# EAGLE design adcmp582-sampler-v2 (EAGLE 9.4.1)
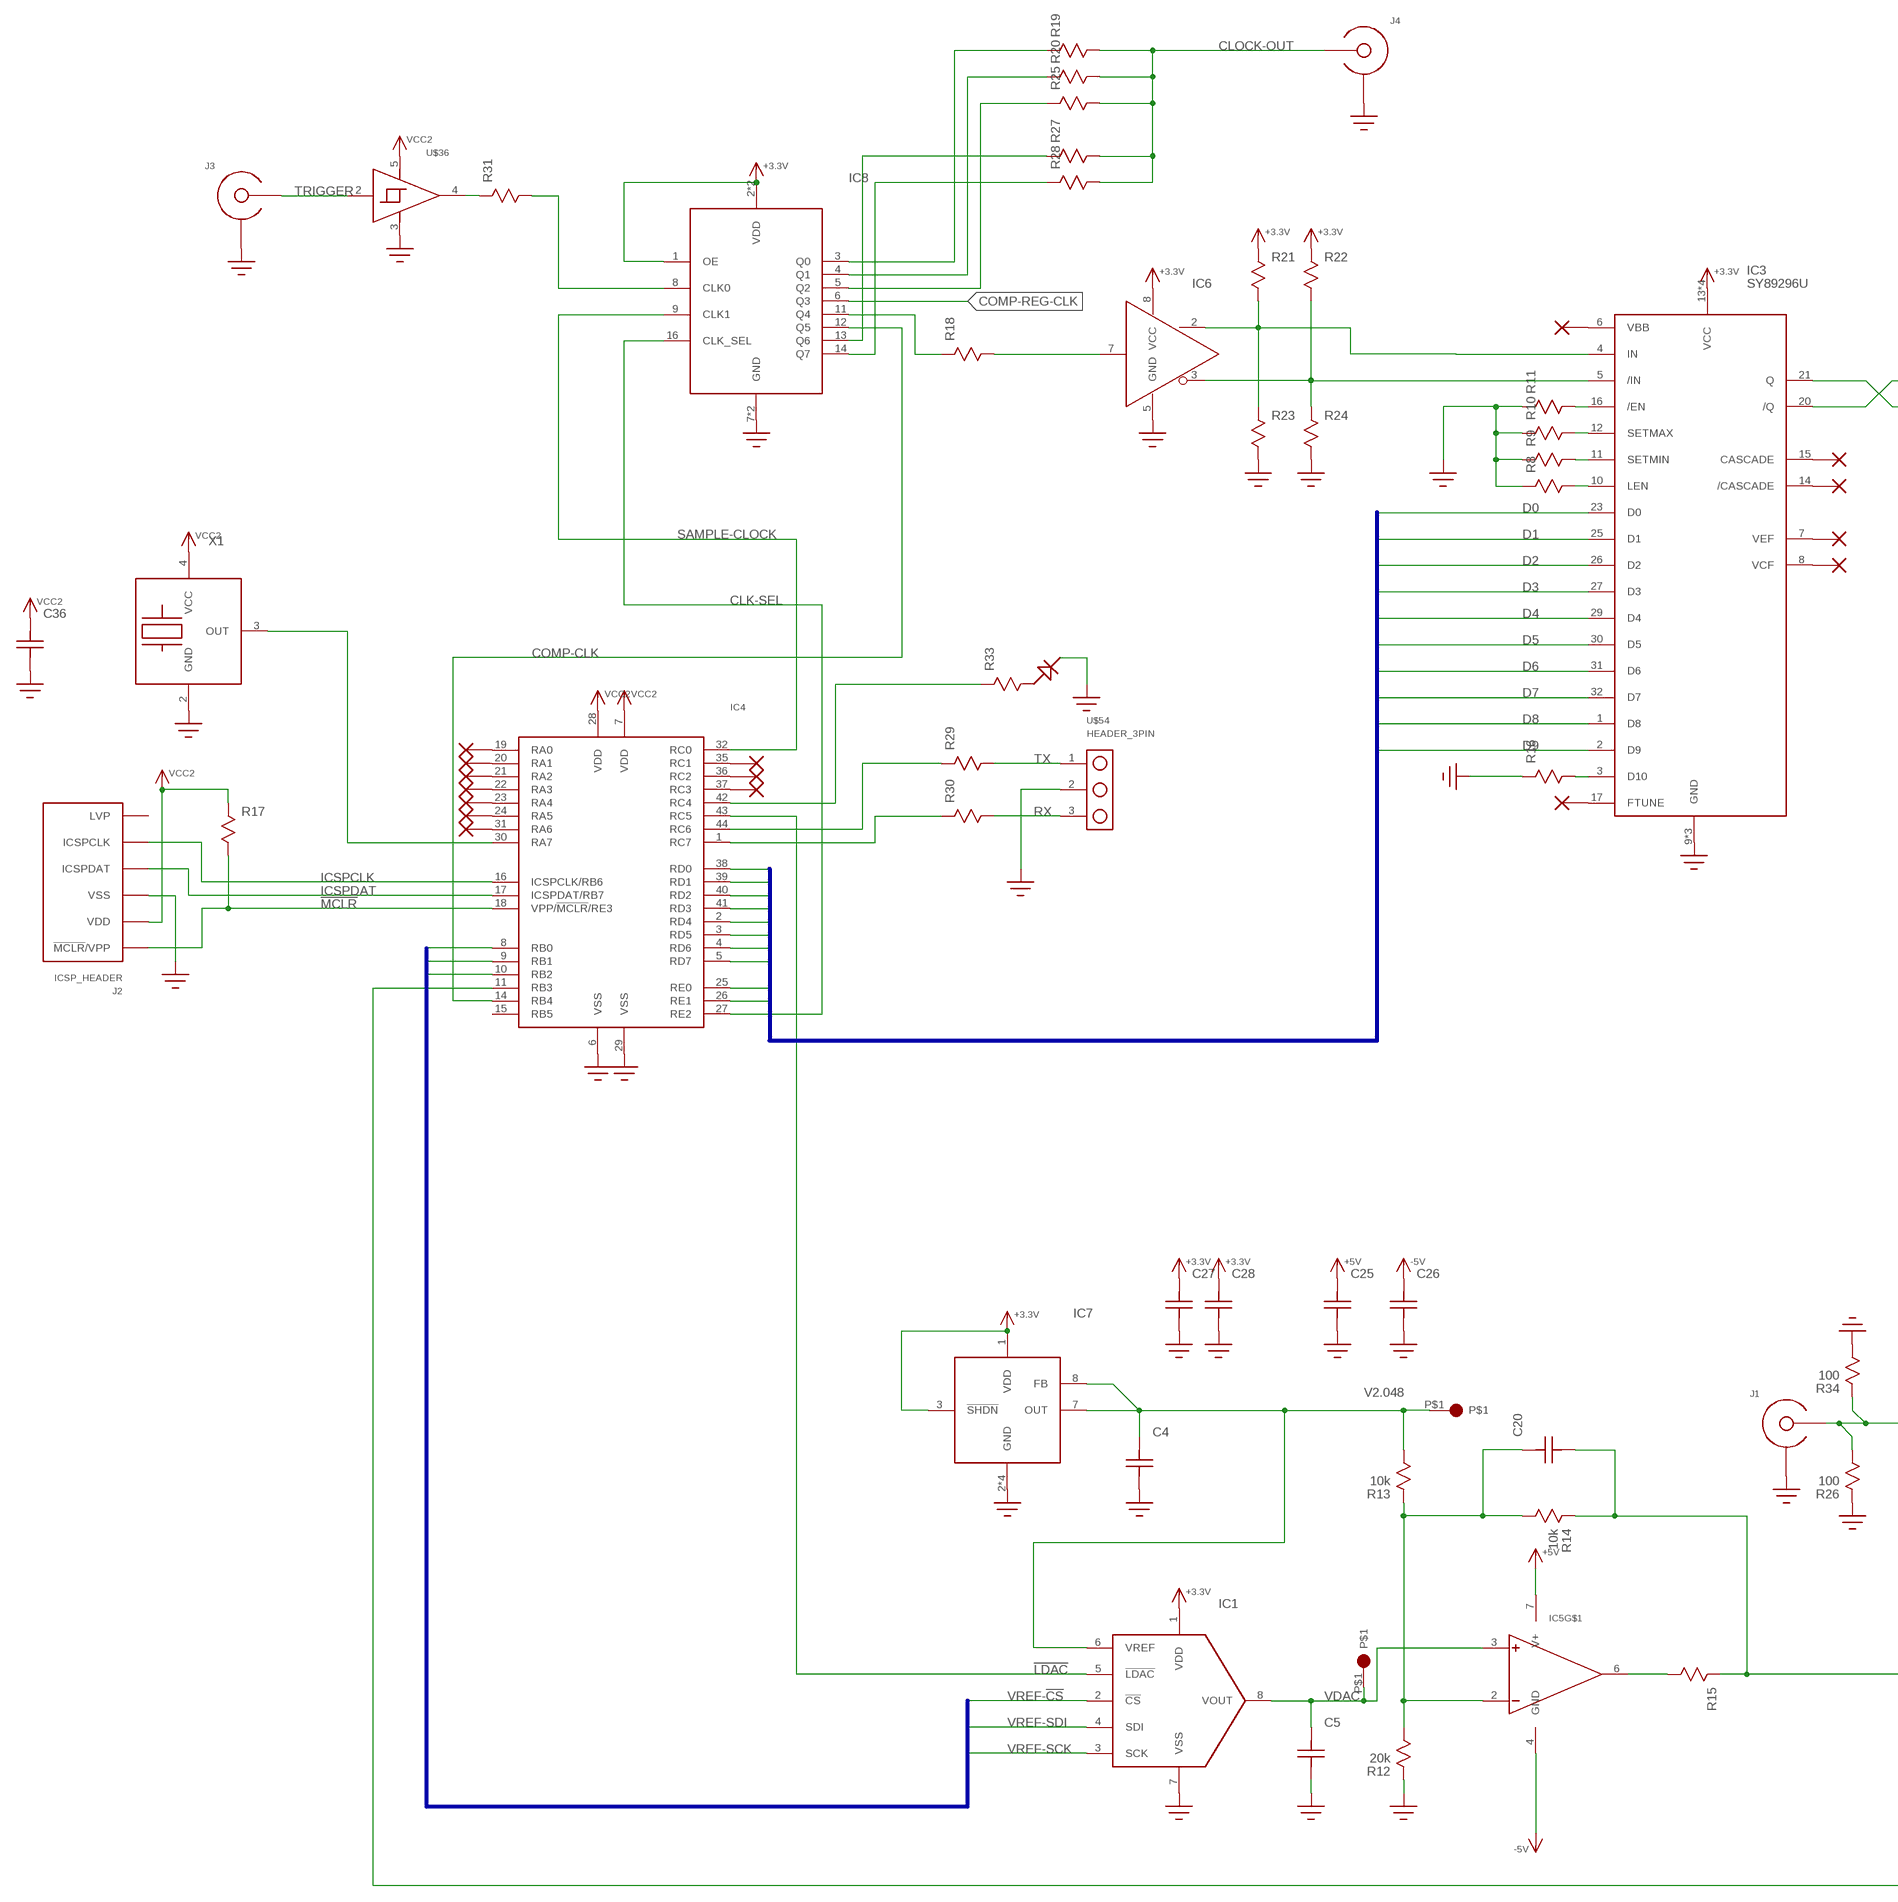
[diagram p0: schematic, sheet 1, part 1 of 2]
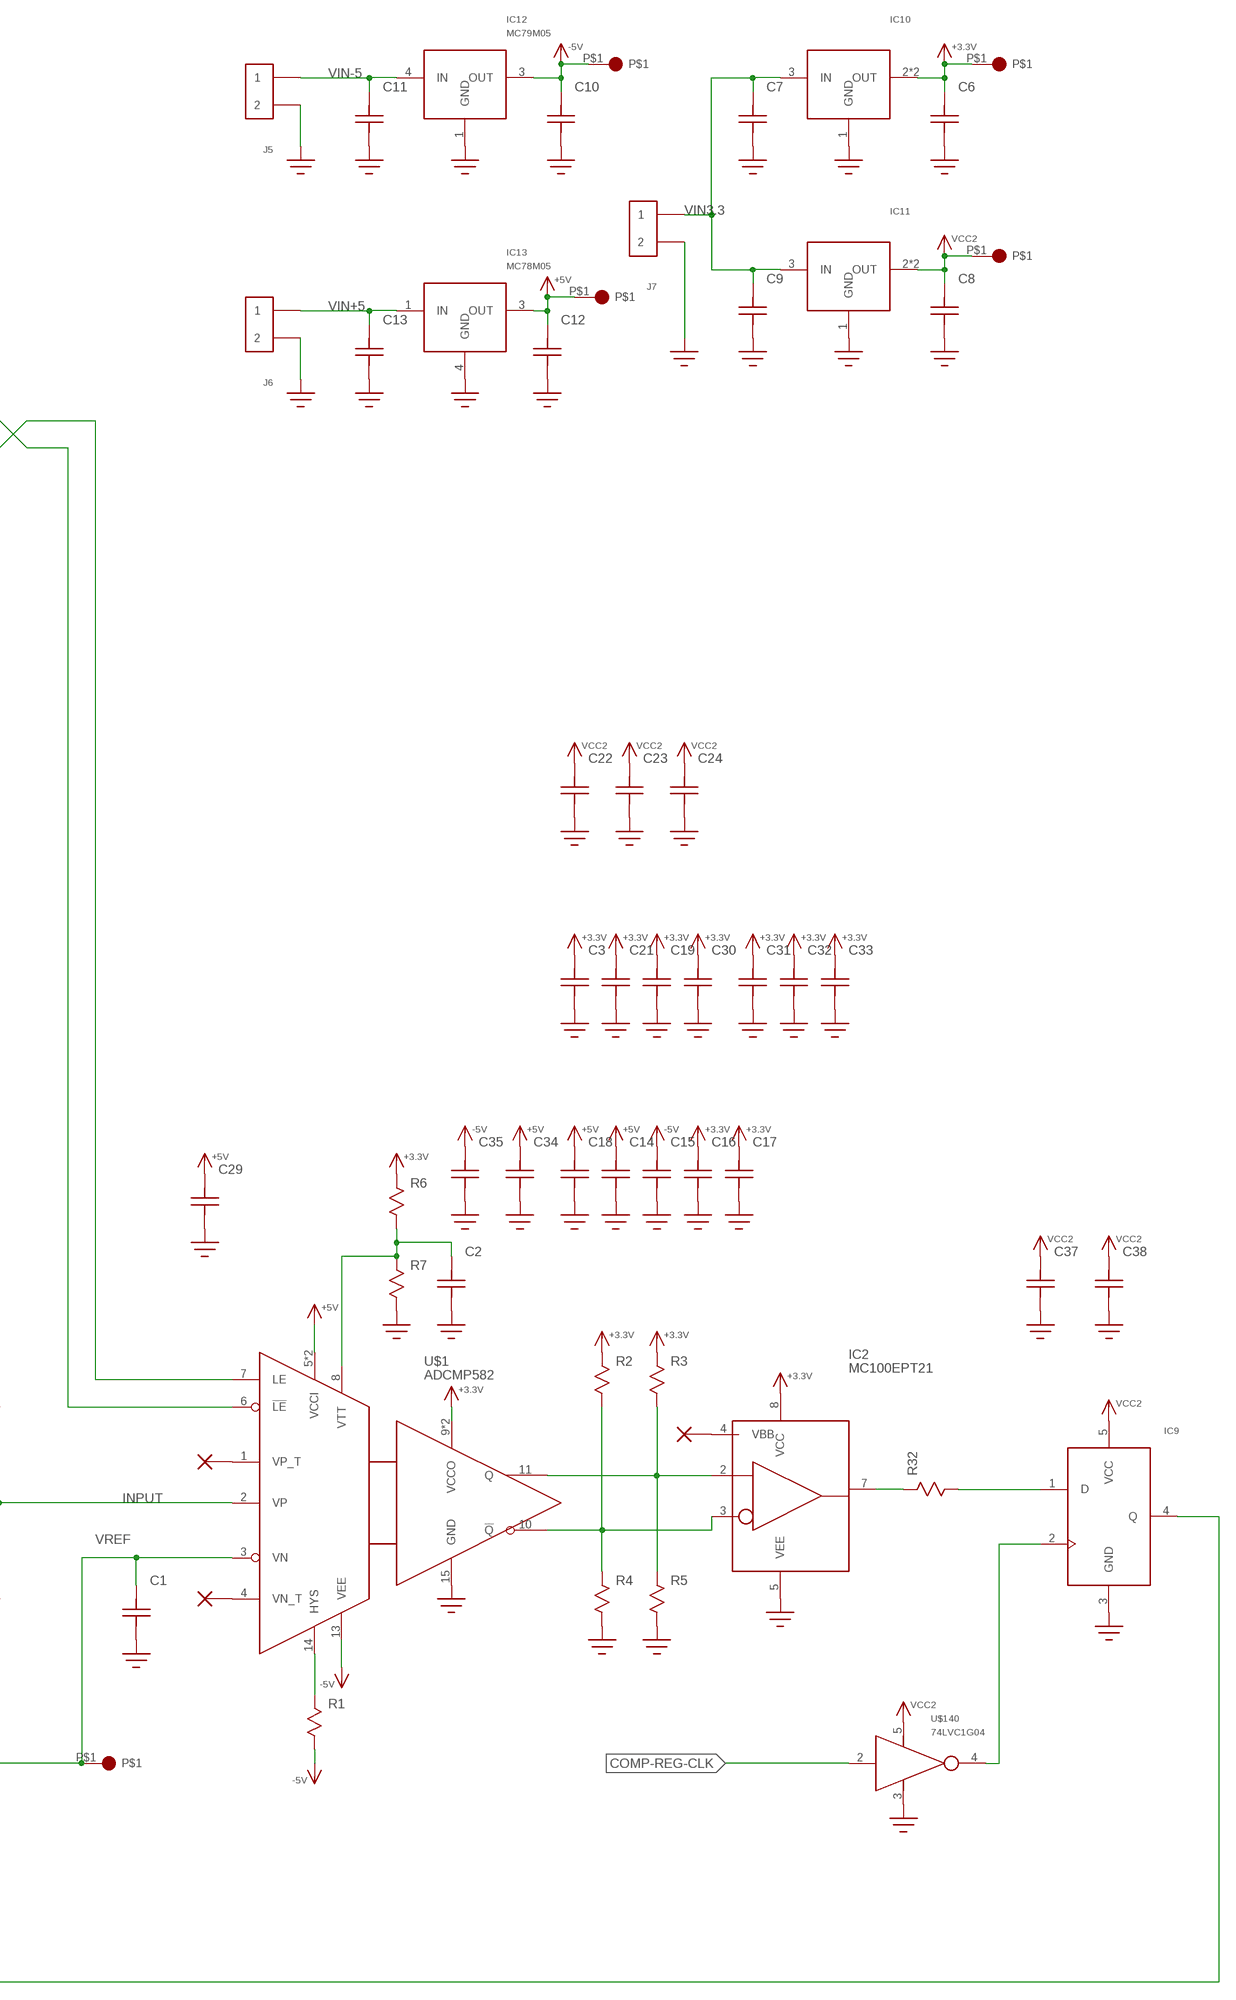
[diagram p1: schematic, sheet 1, part 2 of 2]

## Parts
C1  C0603  [C0603]
C2  C0402_NO_THERMALS  [C0402_NO_THERMALS]
C3  C0603  [C0603]
C4  C0603  [C0603]
C5  C0603  [C0603]
C6  C1206  [1206]
C7  C1206  [1206]
C8  C1206  [1206]
C9  C1206  [1206]
C10  C1206  [1206]
C11  C1206  [1206]
C12  C1206  [1206]
C13  C1206  [1206]
C14  C0402_NO_THERMALS  [C0402_NO_THERMALS]
C15  C0402_NO_THERMALS  [C0402_NO_THERMALS]
C16  C0402_NO_THERMALS  [C0402_NO_THERMALS]
C17  C0402_NO_THERMALS  [C0402_NO_THERMALS]
C18  C0402_NO_THERMALS  [C0402_NO_THERMALS]
C19  C0603  [C0603]
C20  C0603  [C0603]
C21  C0603  [C0603]
C22  C0603  [C0603]
C23  C0603  [C0603]
C24  C0603  [C0603]
C25  C0603  [C0603]
C26  C0603  [C0603]
C27  C0603  [C0603]
C28  C0603  [C0603]
C29  C1206  [1206]
C30  C0603  [C0603]
C31  C0603  [C0603]
C32  C0603  [C0603]
C33  C0603  [C0603]
C34  C0603  [C0603]
C35  C0603  [C0603]
C36  C0603  [C0603]
C37  C0603  [C0603]
C38  C0603  [C0603]
IC1  MCP49X1  [SOIC8]
IC2  MC100EPT21  [SOIC8]
IC3  SY89296U  [TQFP32_7X7]
IC4  PIC16F15376  [TQFP44]
IC5  ADA4000  [SOIC8]
IC6  MC100LVELT20  [SOIC8]
IC7  MCP1501SOIC8  [SOIC8]
IC8  SI53360TSSOP16  [TSSOP16]
IC9  74LVC1G79  [SOT23-5]
IC10  AZ1117E  [SOT-223]
IC11  AZ1117E  [SOT-223]
IC12  MC79M05  MC79M00  [DPAK]
IC13  MC78M05  MC78M00  [DPAK]
J1  SMA-EDGE-LAUNCH4L-4020-TAPER-FIXED  [SMA_EDGE_LAUNCH_4L_4020_TAPER_FIXED]
J2  ICSP_HEADER  [HEADER_6PIN]
J3  SMA-EDGE-LAUNCH4L-4020-TAPER-FIXED  [SMA_EDGE_LAUNCH_4L_4020_TAPER_FIXED]
J4  SMA-EDGE-LAUNCH4L-4020-TAPER-FIXED  [SMA_EDGE_LAUNCH_4L_4020_TAPER_FIXED]
J5  HEADER_2PINSCREW-TERM  [FCI_20020316_SCREW_TERM_2P]
J6  HEADER_2PINSCREW-TERM  [FCI_20020316_SCREW_TERM_2P]
J7  HEADER_2PINSCREW-TERM  [FCI_20020316_SCREW_TERM_2P]
P1  ICSP_PAD  [ICSP_PAD]
P2  ICSP_PAD  [ICSP_PAD]
P3  ICSP_PAD  [ICSP_PAD]
P4  ICSP_PAD  [ICSP_PAD]
P5  ICSP_PAD  [ICSP_PAD]
P6  ICSP_PAD  [ICSP_PAD]
P7  ICSP_PAD  [ICSP_PAD]
R1  R0603  [R0603]
R2  R0603  [R0603]
R3  R0603  [R0603]
R4  R0603  [R0603]
R5  R0603  [R0603]
R6  R0603  [R0603]
R7  R0603  [R0603]
R8  R0402  [0402]
R9  R0402  [0402]
R10  R0402  [0402]
R11  R0402  [0402]
R12  20k  R0603  [R0603]
R13  10k  R0603  [R0603]
R14  10k  R0603  [R0603]
R15  R0603  [R0603]
R16  R0603  [R0603]
R17  R0603  [R0603]
R18  R0603  [R0603]
R19  R0402  [0402]
R20  R0402  [0402]
R21  R0603  [R0603]
R22  R0603  [R0603]
R23  R0603  [R0603]
R24  R0603  [R0603]
R25  R0402  [0402]
R26  100  R0402  [0402]
R27  R0402  [0402]
R28  R0402  [0402]
R29  R0603  [R0603]
R30  R0603  [R0603]
R31  R0603  [R0603]
R32  R0603  [R0603]
R33  R0603  [R0603]
R34  100  R0402  [0402]
U$1  ADCMP582  [TQFN16-EP]
U$3  NO_CONNECT  (no package)
U$24  NO_CONNECT  (no package)
U$25  NO_CONNECT  (no package)
U$26  NO_CONNECT  (no package)
U$27  NO_CONNECT  (no package)
U$28  NO_CONNECT  (no package)
U$29  NO_CONNECT  (no package)
U$36  74LVC1G17  [SOT23-5]
U$54  HEADER_3PIN  [HEADER_3PIN]
U$56  NO_CONNECT  (no package)
U$57  NO_CONNECT  (no package)
U$86  NO_CONNECT  (no package)
U$87  NO_CONNECT  (no package)
U$88  LED_0603  [LED_0603]
U$90  NO_CONNECT  (no package)
U$91  NO_CONNECT  (no package)
U$92  NO_CONNECT  (no package)
U$93  NO_CONNECT  (no package)
U$94  NO_CONNECT  (no package)
U$95  NO_CONNECT  (no package)
U$96  NO_CONNECT  (no package)
U$98  NO_CONNECT  (no package)
U$140  74LVC1G04  [SOT23-5]
X1  XTAL_OSC  [XTAL_3.2X5]

## Nets
!LDAC!: IC1.5(!LDAC!) IC4.43(RC5)
!MCLR!: IC4.18(VPP/!MCLR!/RE3) J2.1(!MCLR!/VPP) R17.P$2
+3.3V: C3.P$2 C6.P$2 C16.2 C17.2 C19.P$2 C21.P$2 C27.P$2 C28.P$2 C30.P$2 C31.P$2 C32.P$2 C33.P$2 IC1.1(VDD) IC2.8(VCC) IC3.13(VCC) IC3.18(VCC) IC3.19(VCC) IC3.22(VCC) IC6.8(VCC) IC7.1(VDD) IC7.3(!SHDN!) IC8.1(OE) IC8.2(VDD) IC8.15(VDD) IC10.2(OUT) IC10.4(OUT) P5.P$1 R2.P$1 R3.P$1 R6.P$1 R21.P$1 R22.P$1 U$1.9(VCCO) U$1.12(VCCO)
+5V: C12.P$2 C14.2 C18.2 C25.P$2 C29.P$2 C34.P$2 IC5.7(V+) IC13.3(OUT) P4.P$1 U$1.5(VCCI) U$1.16(VCCI)
-5V: C10.P$2 C15.2 C26.P$2 C35.P$2 IC5.4(GND) IC12.3(OUT) P3.P$1 R1.P$2 U$1.13(VEE)
CLK-SEL: IC4.27(RE2) IC8.16(CLK_SEL)
CLOCK-OUT: J4.CENTER@1(CENTER) J4.P$3(CENTER) R19.2 R20.2 R25.2 R27.2 R28.2
COMP-CLK: IC4.14(RB4) IC8.12(Q5)
COMP-OUT: IC4.11(RB3) IC9.4(Q)
COMP-REG-CLK: IC8.6(Q3) U$140.2(IN)
D0: IC3.23(D0) IC4.38(RD0)
D1: IC3.25(D1) IC4.39(RD1)
D2: IC3.26(D2) IC4.40(RD2)
D3: IC3.27(D3) IC4.41(RD3)
D4: IC3.29(D4) IC4.2(RD4)
D5: IC3.30(D5) IC4.3(RD5)
D6: IC3.31(D6) IC4.4(RD6)
D7: IC3.32(D7) IC4.5(RD7)
D8: IC3.1(D8) IC4.25(RE0)
D9: IC3.2(D9) IC4.26(RE1)
GND: C1.P$1 C2.1 C3.P$1 C4.P$1 C5.P$1 C6.P$1 C7.P$1 C8.P$1 C9.P$1 C10.P$1 C11.P$1 C12.P$1 C13.P$1 C14.1 C15.1 C16.1 C17.1 C18.1 C19.P$1 C21.P$1 C22.P$1 C23.P$1 C24.P$1 C25.P$1 C26.P$1 C27.P$1 C28.P$1 C29.P$1 C30.P$1 C31.P$1 C32.P$1 C33.P$1 C34.P$1 C35.P$1 C36.P$1 C37.P$1 C38.P$1 IC1.7(VSS) IC2.5(VEE) IC3.9(GND) IC3.24(GND) IC3.28(GND) IC4.6(VSS) IC4.29(VSS) IC6.5(GND) IC7.2(GND) IC7.4(GND) IC7.5(GND) IC7.6(GND) IC8.7(GND) IC8.10(GND) IC9.3(GND) IC10.1(GND) IC11.1(GND) IC12.1(GND) IC13.4(GND) J1.BOTTOM_GND(SHIELD) J1.GND@1(SHIELD) J1.GND@2(SHIELD) J1.GND@3(SHIELD) J1.GND@4(SHIELD) J1.GND@5(SHIELD) J1.GND@6(SHIELD) J1.GND@7(SHIELD) J1.GND@8(SHIELD) J1.GND@14(SHIELD) J1.GND@15(SHIELD) J1.GND@16(SHIELD) J1.GND@17(SHIELD) J1.GND_PAD1(SHIELD) J1.GND_PAD2(SHIELD) J1.P$1(SHIELD) J1.P$2(SHIELD) J2.3(VSS) J3.BOTTOM_GND(SHIELD) J3.GND@1(SHIELD) J3.GND@2(SHIELD) J3.GND@3(SHIELD) J3.GND@4(SHIELD) J3.GND@5(SHIELD) J3.GND@6(SHIELD) J3.GND@7(SHIELD) J3.GND@8(SHIELD) J3.GND@14(SHIELD) J3.GND@15(SHIELD) J3.GND@16(SHIELD) J3.GND@17(SHIELD) J3.GND_PAD1(SHIELD) J3.GND_PAD2(SHIELD) J3.P$1(SHIELD) J3.P$2(SHIELD) J4.BOTTOM_GND(SHIELD) J4.GND@1(SHIELD) J4.GND@2(SHIELD) J4.GND@3(SHIELD) J4.GND@4(SHIELD) J4.GND@5(SHIELD) J4.GND@6(SHIELD) J4.GND@7(SHIELD) J4.GND@8(SHIELD) J4.GND@14(SHIELD) J4.GND@15(SHIELD) J4.GND@16(SHIELD) J4.GND@17(SHIELD) J4.GND_PAD1(SHIELD) J4.GND_PAD2(SHIELD) J4.P$1(SHIELD) J4.P$2(SHIELD) J5.P$2 J6.P$2 J7.P$2 R4.P$2 R5.P$2 R7.P$2 R8.1 R9.1 R10.1 R11.1 R12.P$1 R16.P$1 R23.P$2 R24.P$2 R26.1 R34.2 U$1.15(GND) U$36.3(GND) U$54.2 U$88.C U$140.3(GND) X1.2(GND)
ICSPCLK: IC4.16(ICSPCLK/RB6) J2.5(ICSPCLK)
ICSPDAT: IC4.17(ICSPDAT/RB7) J2.4(ICSPDAT)
INPUT: J1.CENTER@1(CENTER) J1.P$3(CENTER) R26.2 R34.1 U$1.2(VP)
LE_N: IC3.21(Q) U$1.6(!LE!)
LE_P1: IC3.20(/Q) U$1.7(LE)
N$1: R31.P$1 U$36.4(OUT)
N$2: R1.P$1 U$1.14(HYS)
N$3: IC2.2(D) R3.P$2 R5.P$1 U$1.11(Q)
N$4: IC2.3(!D!) R2.P$2 R4.P$1 U$1.10(!Q!)
N$5: C2.2 R6.P$2 R7.P$1 U$1.8(VTT)
N$6: IC3.16(/EN) R11.2
N$7: IC3.12(SETMAX) R10.2
N$8: IC3.11(SETMIN) R9.2
N$9: IC3.10(LEN) R8.2
N$10: IC3.15(CASCADE) U$24.P$1
N$11: IC3.14(/CASCADE) U$25.P$1
N$12: IC3.7(VEF) U$26.P$1
N$13: IC3.8(VCF) U$27.P$1
N$14: IC3.6(VBB) U$28.P$1
N$15: IC2.4(VBB) U$29.P$1
N$16: IC3.4(IN) IC6.2(Q) R21.P$2 R23.P$1
N$17: IC2.7(Q) R32.P$1
N$18: IC8.11(Q4) R18.P$1
N$19: IC9.2(CLK) U$140.4(OUT)
N$20: C20.P$2 IC5.2(-) R12.P$2 R13.P$1 R14.P$2
N$21: U$1.1(VP_T) U$3.P$1
N$22: IC3.5(/IN) IC6.3(!Q!) R22.P$2 R24.P$1
N$23: IC8.8(CLK0) R31.P$2
N$24: IC4.30(RA7) X1.3(OUT)
N$25: IC4.42(RC4) R33.P$1
N$26: R33.P$2 U$88.A
N$27: IC9.1(D) R32.P$2
N$28: IC5.6(OUT) R15.P$2
N$29: U$1.4(VN_T) U$56.P$1
N$35: IC3.3(D10) R16.P$2
N$36: IC6.7(D) R18.P$2
N$38: IC8.14(Q7) R28.1
N$39: IC8.13(Q6) R27.1
N$41: IC8.5(Q2) R25.1
N$42: IC8.4(Q1) R20.1
N$43: IC8.3(Q0) R19.1
N$44: IC4.44(RC6) R29.P$1
N$45: IC4.1(RC7) R30.P$1
N$47: IC4.35(RC1) U$57.P$1
N$48: IC4.36(RC2) U$86.P$1
N$49: IC4.37(RC3) U$87.P$1
N$52: IC3.17(FTUNE) U$90.P$1
N$53: IC4.19(RA0) U$91.P$1
N$54: IC4.20(RA1) U$92.P$1
N$55: IC4.21(RA2) U$93.P$1
N$56: IC4.22(RA3) U$94.P$1
N$57: IC4.23(RA4) U$95.P$1
N$58: IC4.24(RA5) U$96.P$1
N$60: IC4.31(RA6) U$98.P$1
RX: R30.P$2 U$54.3
SAMPLE-CLOCK: IC4.32(RC0) IC8.9(CLK1)
TRIGGER: J3.CENTER@1(CENTER) J3.P$3(CENTER) U$36.2(IN)
TX: R29.P$2 U$54.1
V2.048: C4.P$2 IC1.6(VREF) IC7.7(OUT) IC7.8(FB) P7.P$1 R13.P$2
VCC2: C8.P$2 C22.P$2 C23.P$2 C24.P$2 C36.P$2 C37.P$2 C38.P$2 IC4.7(VDD) IC4.28(VDD) IC9.5(VCC) IC11.2(OUT) IC11.4(OUT) J2.2(VDD) P6.P$1 R17.P$1 U$36.5(VCC) U$140.5(VCC) X1.4(VCC)
VDAC: C5.P$2 IC1.8(VOUT) IC5.3(+) P2.P$1
VIN3.3: C7.P$2 C9.P$2 IC10.3(IN) IC11.3(IN) J7.P$1
VIN+5: C13.P$2 IC13.1(IN) J6.P$1
VIN-5: C11.P$2 IC12.4(IN) J5.P$1
VREF: C1.P$2 C20.P$1 P1.P$1 R14.P$1 R15.P$1 U$1.3(VN)
VREF-!CS!: IC1.2(!CS!) IC4.8(RB0)
VREF-SCK: IC1.3(SCK) IC4.9(RB1)
VREF-SDI: IC1.4(SDI) IC4.10(RB2)
Unconnected: IC4.15(RB5) J2.6(LVP)

## Buses
D0,D1,D2,D3,D4,D5,D6,D7,D8,D9
VREF-!CS!,VREF-SCK,VREF-SDI

## Library data of the parts
C1-C38 = yapo:C
IC1 = yapo:MCP49X1
IC2 = yapo:MC100EPT21
IC3 = yapo:SY89296U
IC4 = yapo:PIC16F15376
IC5 = yapo:ADA4000
IC6 = yapo:MC100LVELT20
IC7 = yapo:MCP1501
IC8 = yapo:SI53360
IC9 = yapo:74LVC1G79
IC10 IC11 = yapo:AZ1117E
IC12 = yapo:MC79M00
IC13 = yapo:MC78M00
J1 J3 J4 = sma_footprint_2l:SMA-EDGE-LAUNCH
J2 = yapo:ICSP_HEADER
J5-J7 = yapo:HEADER_2PIN
P1-P7 = yapo:ICSP_PAD
R1-R34 = yapo:R
U$1 = yapo:ADCMP582
U$3 U$24-U$29 U$56 U$57 U$86 U$87 U$90-U$96 U$98 = yapo:NO_CONNECT
U$36 = yapo:74LVC1G17
U$54 = yapo:HEADER_3PIN
U$88 = yapo:LED_0603
U$140 = yapo:74LVC1G04
X1 = yapo:XTAL_OSC

## Net classes
1 diff-pair: width 0.33 mm, clearance 0.203 mm
2 50-ohm: width 0.349 mm

## Board
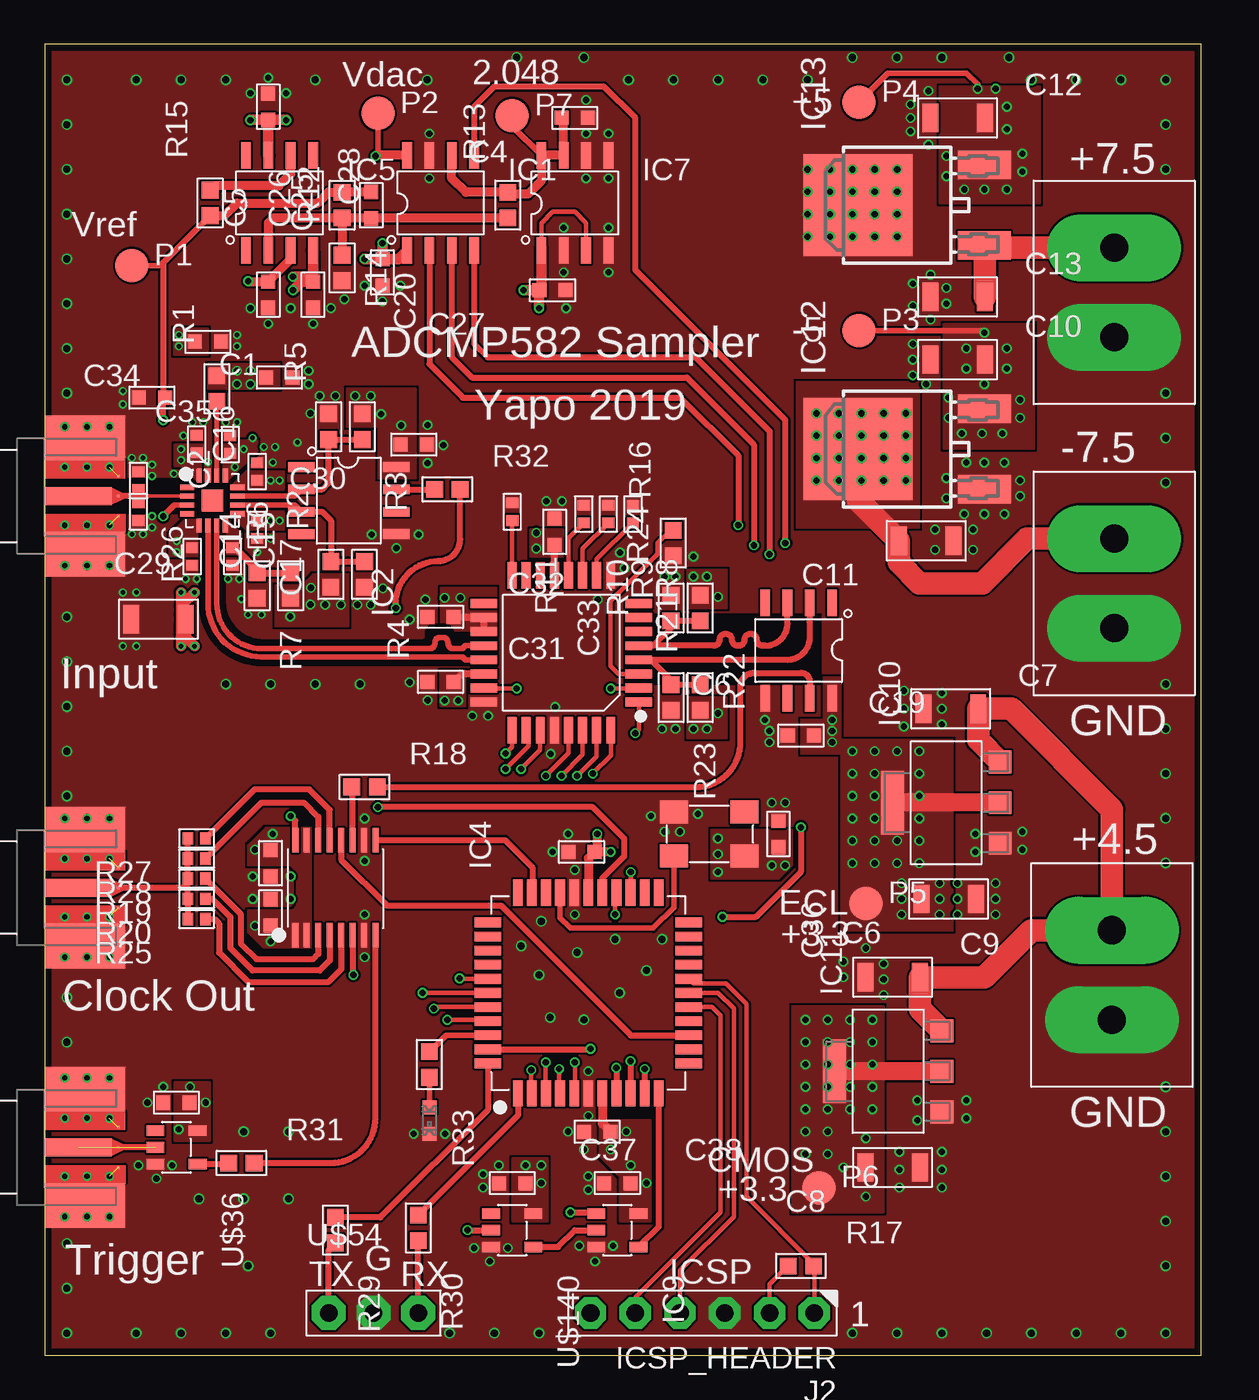
[diagram p2: board, top side]
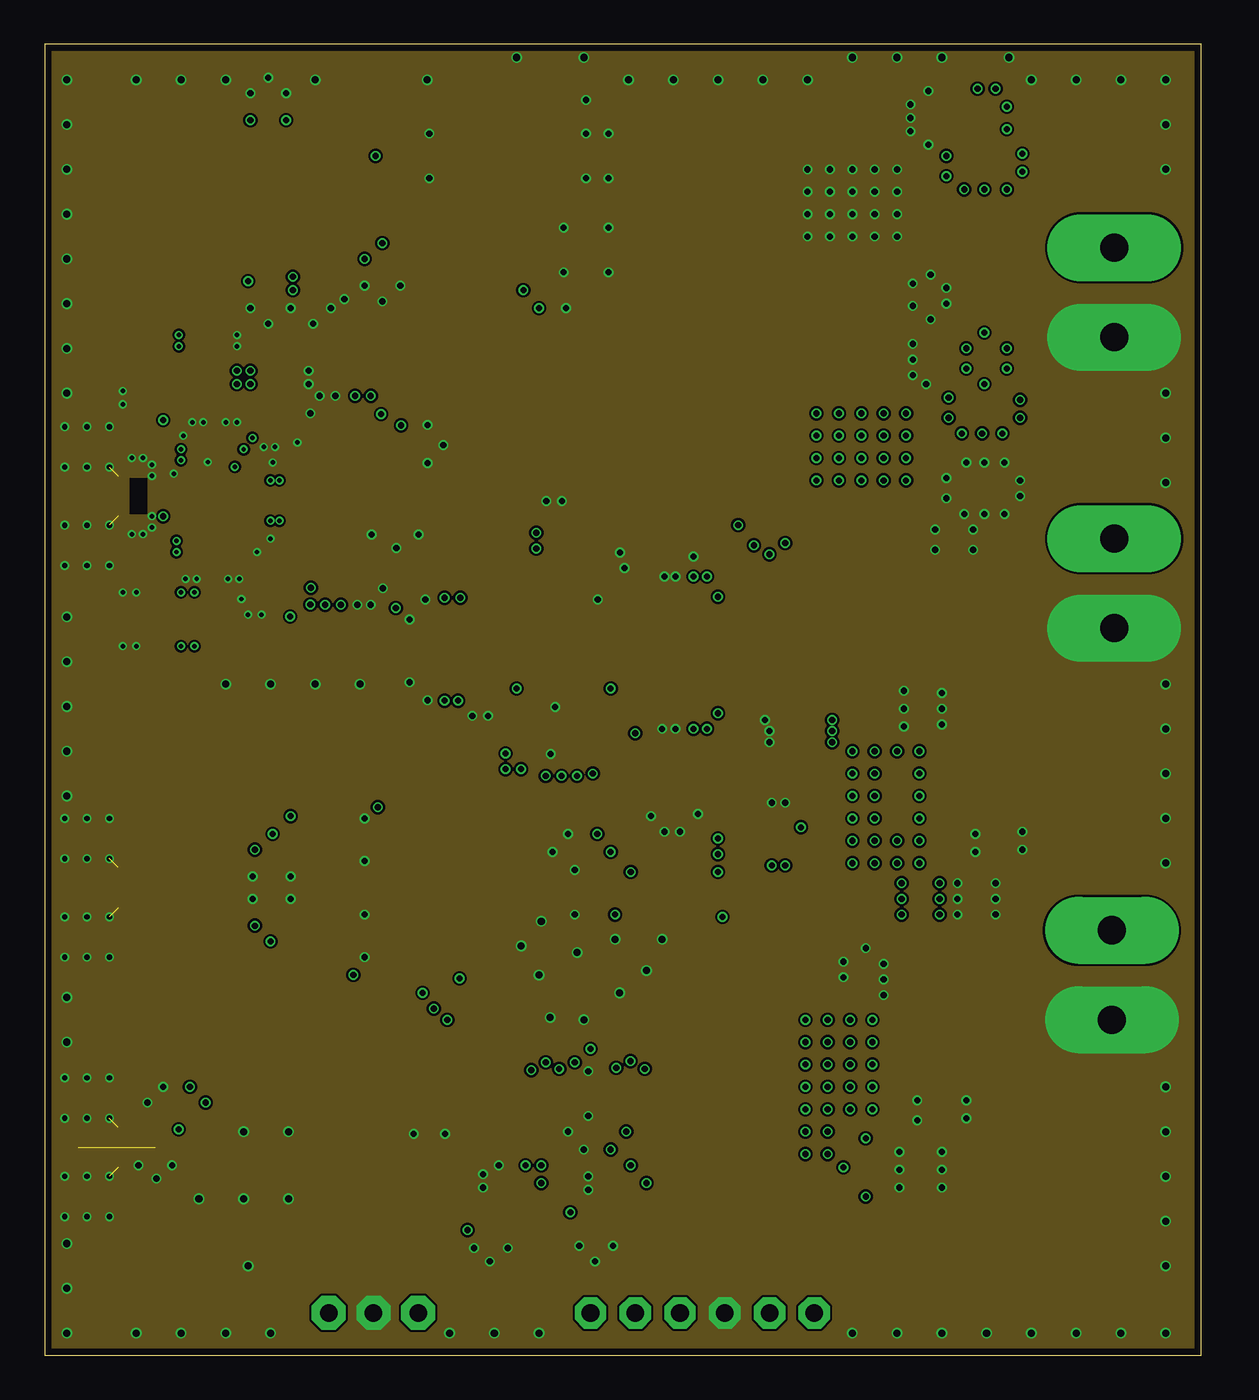
[diagram p3: board, inner layer Route2]
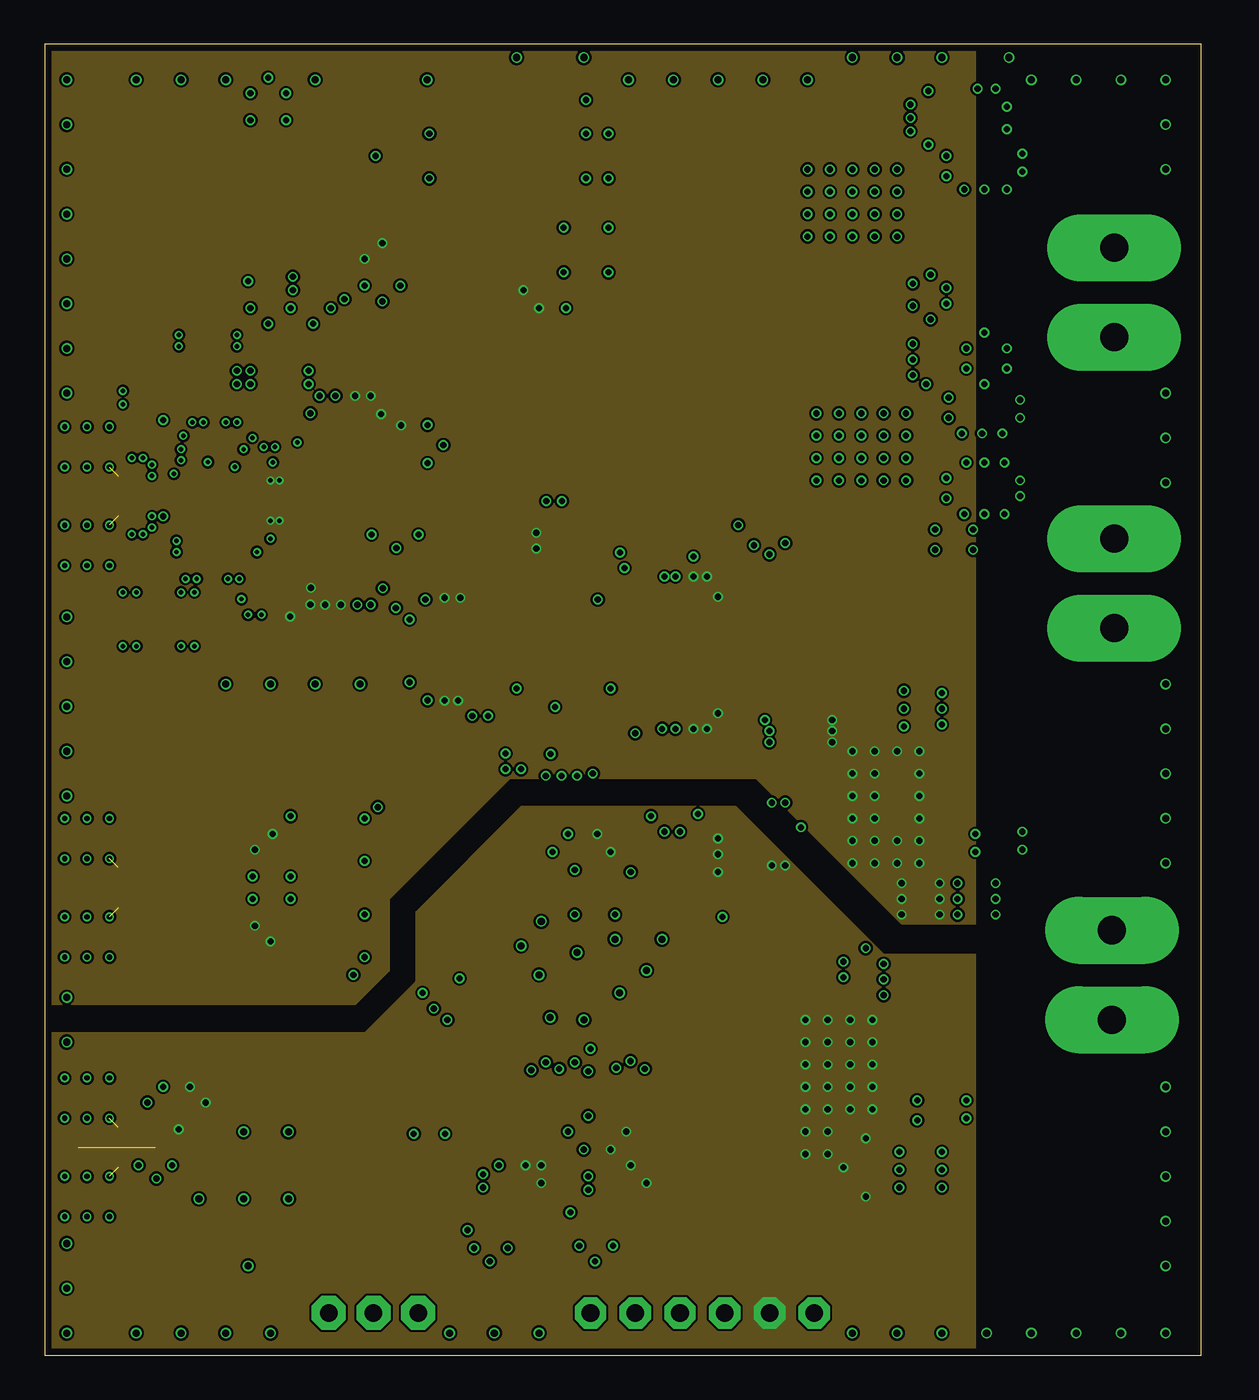
[diagram p4: board, inner layer Route15]
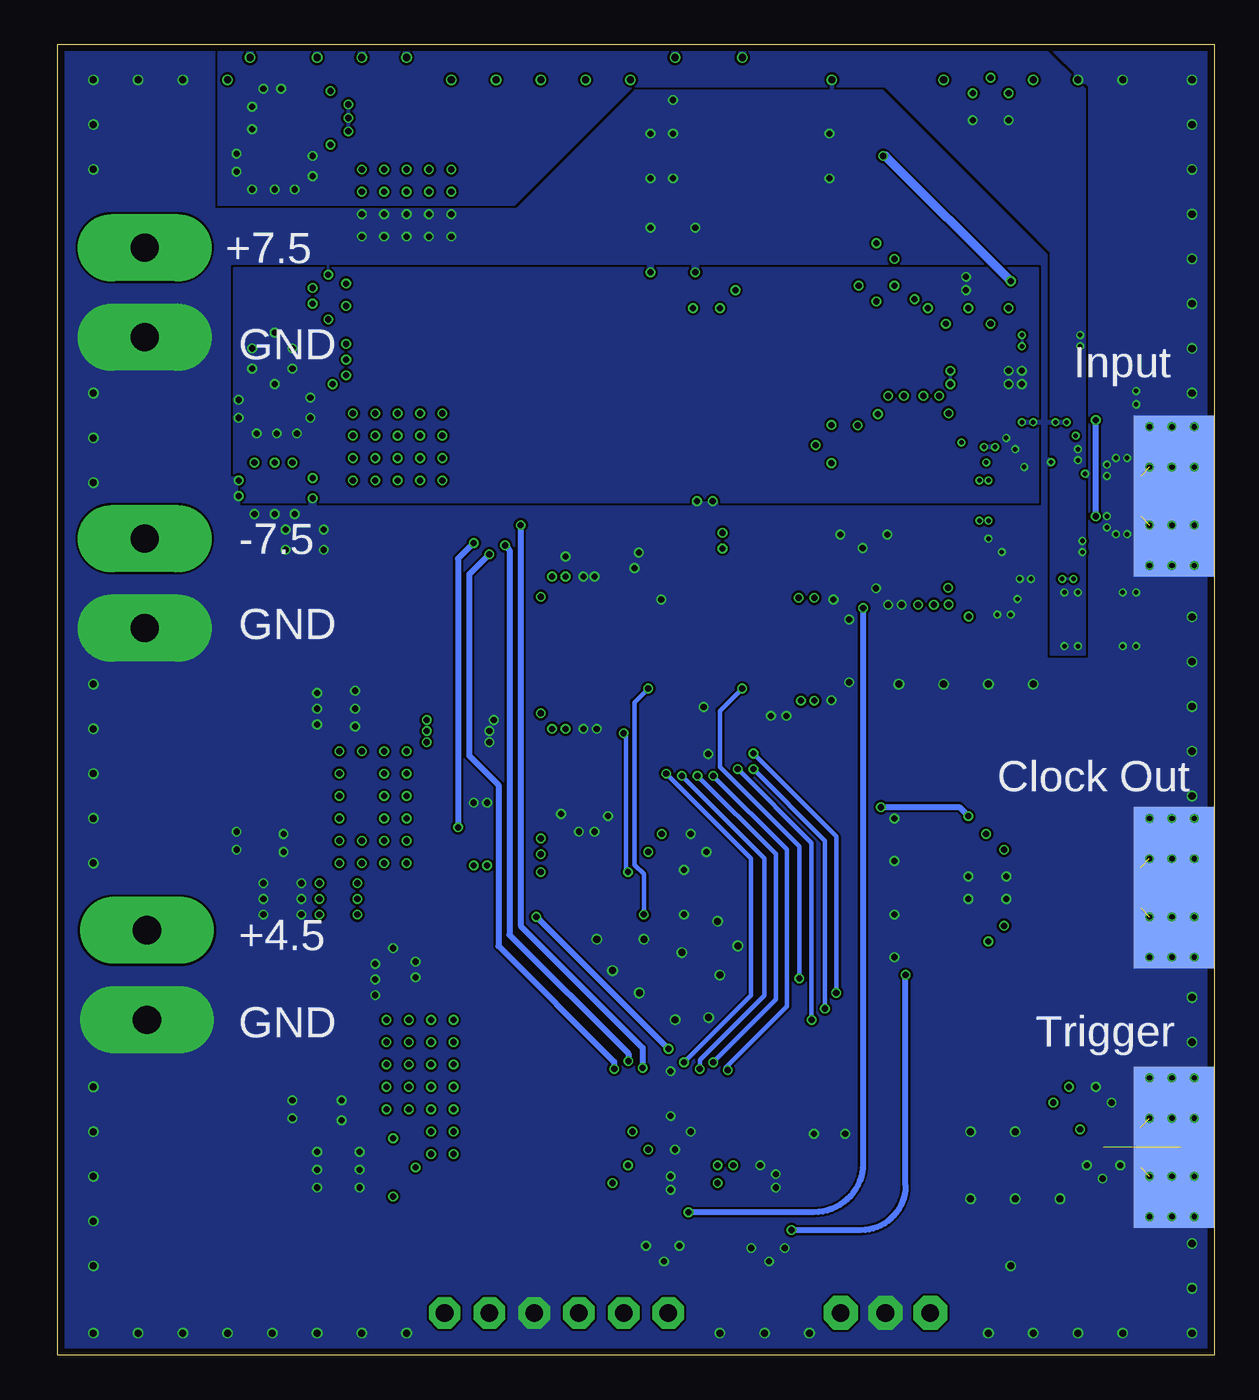
[diagram p5: board, bottom side, seen from below]

Size 65.66 x 74.42 mm. Coordinates in mm from the lower left corner, seen from the top.
Outline: 0,0 65.66,0 65.66,74.42 0,74.42 0,0
Copper layers (1*2*15*16): Top 0.035559375mm / dielectric 0.17018125mm / Route2 0.01778125mm / dielectric 47mil / Route15 0.01778125mm / dielectric 0.17018125mm / Bottom 0.035559375mm
Design rules "oshpark-4layer *": minimum track width 5mil, minimum drill 10mil, track to track 5mil, track to pad 5mil, pad to pad 5mil, via to via 5mil, smd to smd 5mil, copper to edge 15mil, drill to drill 6mil, minimum pad ring 4mil, minimum via ring 4mil, stop-mask expansion 2.5mil, vias tented up to drill 20mil, thermal gap 10mil

### Footprints (pad centres in the part's own frame; a part is rotated, then mirrored left to right if it is on the bottom)
C0603 = smd 0.8 x 0.8: P$1 -0.75,0; P$2 0.75,0
C0402_NO_THERMALS = smd 0.6 x 0.7: 1 -0.5,0; 2 0.5,0
1206 = smd 0.9 x 1.6: P$1 -1.55,0; P$2 1.55,0
SOIC8 = smd 0.55 x 1.5: 1 -1.905,-2.7; 2 -0.635,-2.7; 3 0.635,-2.7; 4 1.905,-2.7; 5 1.905,2.7; 6 0.635,2.7; 7 -0.635,2.7; 8 -1.905,2.7
TQFP32_7X7 = smd 1.5 x 0.5: 1 -4.4,2.8; 2 -4.4,2; 3 -4.4,1.2; 4 -4.4,0.4; 5 -4.4,-0.4; 6 -4.4,-1.2; 7 -4.4,-2; 8 -4.4,-2.8; 17 4.4,-2.8; 18 4.4,-2; 19 4.4,-1.2; 20 4.4,-0.4; 21 4.4,0.4; 22 4.4,1.2; 23 4.4,2; 24 4.4,2.8 | smd 0.5 x 1.5: 9 -2.8,-4.4; 10 -2,-4.4; 11 -1.2,-4.4; 12 -0.4,-4.4; 13 0.4,-4.4; 14 1.2,-4.4; 15 2,-4.4; 16 2.8,-4.4; 25 2.8,4.4; 26 2,4.4; 27 1.2,4.4; 28 0.4,4.4; 29 -0.4,4.4; 30 -1.2,4.4; 31 -2,4.4; 32 -2.8,4.4
TQFP44 = smd 1.5 x 0.55: 1 -5.7,4; 2 -5.7,3.2; 3 -5.7,2.4; 4 -5.7,1.6; 5 -5.7,0.8; 6 -5.7,0; 7 -5.7,-0.8; 8 -5.7,-1.6; 9 -5.7,-2.4; 10 -5.7,-3.2; 11 -5.7,-4; 23 5.7,-4; 24 5.7,-3.2; 25 5.7,-2.4; 26 5.7,-1.6; 27 5.7,-0.8; 28 5.7,0; 29 5.7,0.8; 30 5.7,1.6; 31 5.7,2.4; 32 5.7,3.2; 33 5.7,4 | smd 0.55 x 1.5: 12 -4,-5.7; 13 -3.2,-5.7; 14 -2.4,-5.7; 15 -1.6,-5.7; 16 -0.8,-5.7; 17 0,-5.7; 18 0.8,-5.7; 19 1.6,-5.7; 20 2.4,-5.7; 21 3.2,-5.7; 22 4,-5.7; 34 4,5.7; 35 3.2,5.7; 36 2.4,5.7; 37 1.6,5.7; 38 0.8,5.7; 39 0,5.7; 40 -0.8,5.7; 41 -1.6,5.7; 42 -2.4,5.7; 43 -3.2,5.7; 44 -4,5.7
TSSOP16 = smd 0.35 x 1.4: 1 -2.275,-2.7; 2 -1.625,-2.7; 3 -0.975,-2.7; 4 -0.325,-2.7; 5 0.325,-2.7; 6 0.975,-2.7; 7 1.625,-2.7; 8 2.275,-2.7; 9 2.275,2.7; 10 1.625,2.7; 11 0.975,2.7; 12 0.325,2.7; 13 -0.325,2.7; 14 -0.975,2.7; 15 -1.625,2.7; 16 -2.275,2.7
SOT23-5 = smd 0.6 x 1: 1 -0.95,-1.2; 2 0,-1.2; 3 0.95,-1.2; 4 0.95,1.2; 5 -0.95,1.2
SOT-223 = smd 1.3 x 1.3: 1 -2.3,-3.05; 2 0,-3.05; 3 2.3,-3.05 | smd 3.6 x 1.3: 4 0,3.05
DPAK = smd 1.6 x 3: 1 -2.285,0; 3 2.285,0 | smd 5.8 x 6.2: 4 0,7.18
SMA_EDGE_LAUNCH_4L_4020_TAPER_FIXED = smd 4.572 x 9.144 bottom: BOTTOM_GND 2.286,0 | smd 3.81 x 1.016: CENTER@1 1.905,0 | drill 0.3: GND@1 1.143,3.937; GND@2 3.683,3.937; GND@3 1.143,1.651; GND@4 3.683,1.651; GND@5 1.143,-1.651; GND@6 3.683,-1.651; GND@7 1.143,-3.937; GND@8 3.683,-3.937; GND@14 2.413,3.937; GND@15 2.413,-3.937; GND@16 2.413,-1.651; GND@17 2.413,1.651 | smd 4.572 x 2.54: GND_PAD1 2.286,3.302; GND_PAD2 2.286,-3.302 | smd 0.127 x 0.127: P$1 4.191,1.143; P$2 4.191,-1.143; P$3 4.191,0
HEADER_6PIN = drill 1 pad 1.778 octagon: 1 -6.35,0; 2 -3.81,0; 3 -1.27,0; 4 1.27,0; 5 3.81,0; 6 6.35,0
FCI_20020316_SCREW_TERM_2P = drill 1.6 pad 3.81 long: P$1 -2.54,0; P$2 2.54,0
ICSP_PAD = smd 1.905 x 1.905: P$1 0,0
R0603 = smd 0.95 x 0.95: P$1 -0.725,0; P$2 0.725,0
0402 = smd 0.6 x 0.7: 1 -0.5,0; 2 0.5,0
TQFN16-EP = smd 0.3 x 0.8: 1 -0.75,-1.425; 2 -0.25,-1.425; 3 0.25,-1.425; 4 0.75,-1.425; 9 0.75,1.425; 10 0.25,1.425; 11 -0.25,1.425; 12 -0.75,1.425 | smd 0.8 x 0.3: 5 1.425,-0.75; 6 1.425,-0.25; 7 1.425,0.25; 8 1.425,0.75; 13 -1.425,0.75; 14 -1.425,0.25; 15 -1.425,-0.25; 16 -1.425,-0.75 | smd 1.23 x 1.23: EP 0,0
HEADER_3PIN = drill 1 pad 1.93 octagon: 1 -2.54,0; 2 0,0; 3 2.54,0
LED_0603 = smd 0.8 x 0.8: A -0.75,0; C 0.75,0
XTAL_3.2X5 = smd 1.6 x 1.3: 1 -2,-1.25; 2 2,-1.25; 3 2,1.25; 4 -2,1.25

### Placement (x,y rotation side)
C1  6.1,54.36 0 top
C2  10.67,45.34 90 top
C3  12.83,27.94 90 top
C4  30.1,70.23 180 top
C5  12.7,60.2 90 top
C6  51.31,25.91 180 top
C7  51.44,36.7 0 top
C8  48.13,10.67 180 top
C9  48.13,21.46 0 top
C10  51.82,56.52 0 top
C11  50.04,46.23 180 top
C12  51.82,70.23 0 top
C13  51.82,60.07 0 top
C14  8.64,51.71 270 top
C15  10.54,51.69 270 top
C16  12.06,46.86 90 top
C17  12.06,50.16 270 top
C18  8.38,45.34 90 top
C19  42.93,35.18 0 top
C20  18.54,65.28 270 top
C21  12.83,25.15 270 top
C22  30.48,28.57 0 top
C23  31.37,12.7 0 top
C24  7.49,14.35 0 top
C25  12.7,70.87 270 top
C26  15.24,60.2 90 top
C27  28.83,60.45 180 top
C28  19.18,61.47 90 top
C29  6.48,41.78 0 top
C30  20.95,51.69 180 top
C31  22.48,38.23 0 top
C32  22.48,41.91 0 top
C33  28.96,46.74 270 top
C34  9.27,57.53 180 top
C35  13.34,55.5 180 top
C36  41.66,29.59 270 top
C37  26.54,9.78 0 top
C38  32.51,9.78 0 top
IC1  22.48,65.41 0 top
IC2  17.27,48.51 270 top
IC3  29.34,39.88 180 top
IC4  30.86,20.57 90 top
IC5  13.34,65.41 0 top
IC6  42.8,40.01 180 top
IC7  30.1,65.41 0 top
IC8  16.51,26.54 0 top
IC9  32.51,7.11 270 top
IC10  51.18,31.37 90 top
IC11  47.88,16.13 90 top
IC12  53.34,51.44 90 top
IC13  53.34,65.28 90 top
J1  0,48.77 0 top
J2  37.34,2.41 180 top
J3  0,11.81 0 top
J4  0,26.54 0 top
J5  60.71,43.81 270 top
J6  60.71,60.33 270 top
J7  60.58,21.59 270 top
P1  4.95,61.85 0 top
P2  18.92,70.48 0 top
P3  46.23,58.17 0 top
P4  46.23,71.12 0 top
P5  46.61,25.65 0 top
P6  43.94,9.53 0 top
P7  26.54,70.36 0 top
R1  9.78,54.86 90 top
R2  16.26,44.32 90 top
R3  18.03,52.7 270 top
R4  18.16,44.32 270 top
R5  16.13,52.7 90 top
R6  13.97,43.69 90 top
R7  12.06,43.69 270 top
R8  33.4,47.75 270 top
R9  32,47.75 270 top
R10  30.61,47.75 270 top
R11  26.54,47.88 270 top
R12  16.89,61.72 90 top
R13  26.29,65.28 90 top
R14  16.89,65.28 270 top
R15  9.4,65.41 90 top
R16  35.69,46.1 90 top
R17  42.93,5.08 0 top
R18  18.16,32.26 0 top
R19  8.64,27.05 180 top
R20  8.64,25.91 180 top
R21  37.21,37.34 90 top
R22  37.21,42.42 270 top
R23  35.56,37.34 270 top
R24  35.56,42.42 90 top
R25  8.64,24.77 180 top
R26  5.33,49.65 270 top
R27  8.64,29.34 180 top
R28  8.64,28.19 180 top
R29  16.51,7.11 270 top
R30  21.21,7.24 270 top
R31  11.18,10.92 0 top
R32  22.86,49.15 0 top
R33  21.84,16.51 270 top
R34  5.33,47.88 270 top
U$1  9.53,48.51 270 top
U$36  7.49,11.81 270 top
U$54  18.67,2.41 0 top
U$88  21.84,13.34 270 top
U$140  26.54,7.11 270 top
X1  37.72,29.59 180 top

### Tracks (layer width: path | path; a pad name or v marks a point on that pad's centre or on a via)
!LDAC!  (via drill 0.35)
  Top 0.349: IC4.43 30.96,17.37 v30.99,17.4 | v42.93,29.97 42.93,27.43 40.39,24.89 v38.48,24.89 | v42.04,46.1 42.04,53.09 33.53,61.59 33.53,70.23 31.75,72.01 25.53,72.01 24.38,70.87 IC1.5
  Bottom 0.349: v42.04,46.1 42.93,45.21 v42.93,29.97 | v38.48,24.89 v30.99,17.4
!MCLR!
  Top 0.254: IC4.18 36.83,21.1 38.69,21.1 39.84,19.95 39.84,9.02 43.65,5.21 R17.P$2 43.69,5.04 J2.1
+3.3V  (via drill 0.25, 0.35)
  Top 0.254: IC7.1 28.19,62.87 28.19,64.26 28.83,64.9 30.1,64.9 30.73,64.26 IC7.3
  Top 0.406: C32.P$2 23.23,41.88 IC3.18 IC3.19 | IC3.22 23.68,38.68 C31.P$2 | IC3.13 28.94,45.97 arc-90 C33.P$2
  Top 0.61: v19.18,63.12 C28.P$2 | v18.16,62.23 18.17,62.22 C28.P$2 | v28.07,59.44 v28.08,59.45 C27.P$2 | v27.18,60.45 C27.P$2 | C27.P$2 28.19,60.57 28.19,62.87 | C28.P$2 20.09,62.22 IC1.1
  Top 1.016: IC10.2 IC10.4
  other vias: 12.83,47.37 13.34,47.37 12.83,49.66 13.34,49.66 11.94,28.7 11.94,24.38 12.95,29.59 12.83,23.5 17.63,54.46 19.1,53.42 15.11,43.56 15.93,42.6 13.94,41.94 16.81,42.6 18.52,54.46 15.09,42.62 38.23,43.05 37.59,44.2 36.83,44.2 36.83,35.56 37.59,35.56 38.23,36.45 48.64,26.8 48.64,25.91 48.64,25.02 50.8,26.8 50.8,25.91 50.8,25.02 48.39,34.29 49.66,34.29 49.66,33.02 49.66,31.75 49.66,30.48 49.66,29.21 48.39,29.21 47.12,29.21 45.85,27.94 45.85,30.48 45.85,31.75 45.85,33.02 45.85,34.29 47.12,34.29 47.12,33.02 47.12,31.75 47.12,30.48 45.85,29.21 47.12,27.94 48.39,27.94 49.66,27.94 20.24,52.78 22.71,43 23.6,43 22.71,37.16 23.47,37.16 27.91,46.69 27.91,45.8 44.7,36.07 44.7,35.43 44.7,34.8
  pour Top (no thermals): 10.54,47.88 10.54,47.75 11.43,46.86 13.59,46.86 13.59,47.88
  pour Top (no thermals): 10.54,49.15 13.59,49.15 13.59,50.16 11.43,50.16 10.54,49.28
  pour Top (no thermals): 15.11,23.11 12.45,23.11 11.56,24 11.56,25.27 14.1,25.27 14.35,25.53 14.35,27.43 13.97,27.81 11.56,27.81 11.56,28.96 12.57,29.97 15.11,29.97
  pour Top (no thermals): 13.08,43.69 13.08,41.4 17.27,41.4 17.27,44.32 15.24,44.32 14.61,43.69
  pour Top (no thermals): 36.45,42.42 38.73,42.42 38.73,44.58 36.45,44.58
  pour Top (no thermals): 36.45,37.34 36.45,35.05 38.73,35.05 38.73,37.34
  pour Route15 (no thermals): 52.83,24.51 52.83,74.3 52.96,74.42 0,74.42 0,19.94 17.65,19.94 19.56,21.84 19.56,25.91 26.42,32.77 40.39,32.77 48.64,24.51
  pour Top (no thermals): 51.56,24.13 51.56,34.92 45.21,34.92 45.21,24.13
  pour Top (no thermals): 18.92,49.78 21.08,49.78 21.08,54.86 17.14,54.86 17.14,52.7 18.92,52.7
  pour Top (no thermals): 22.48,41.15 25.65,41.15 25.65,43.56 22.48,43.56
  pour Top (no thermals): 22.48,38.86 23.88,38.86 23.88,36.83 22.48,36.83
  pour Top (no thermals): 27.56,45.34 29.46,45.34 29.46,46.86 27.56,46.86
  pour Top (no thermals): 42.93,36.07 42.93,34.16 45.21,34.16 45.21,38.48 44.2,38.48 44.2,36.07
+5V  (via drill 0.25, 0.35)
  Top 0.305: P4.P$1 47.88,72.77 52.32,72.77 52.96,72.14 v52.96,71.88
  Top 0.61: IC5.7 C25.P$2 | v13.72,70.1 13.7,70.12 C25.P$2 | v11.68,70.1 11.7,70.12 C25.P$2 | v7.75,40.26 7.75,41.5 | 7.75,41.5 C29.P$2 | v8.51,40.26 8.03,40.74 C29.P$2 | v7.75,43.31 7.75,42.06 C29.P$2 | v8.51,43.31 7.75,42.55 7.75,41.5
  other vias: 7.49,45.59 7.75,51.44 7.49,46.23 7.75,50.8 53.98,71.88 52.2,66.17 53.34,66.17 54.61,66.17 51.18,68.07 51.18,66.93 54.61,70.87 54.61,69.6 55.5,68.2 55.5,67.18 7.62,57.91 7.62,57.28
  pour Top (no thermals): 8.89,47.5 8.89,45.34 7.11,45.34 7.11,46.61 8,47.5
  pour Top (no thermals): 8.89,49.66 8.89,50.67 9.02,50.8 9.02,51.69 7.37,51.69 7.37,50.48 7.81,50.48 8.64,49.66
  pour Bottom (no thermals): 7.37,39.75 9.27,39.75 9.27,62.61 18.67,72.01 33.02,72.01 39.75,65.28 56.52,65.28 56.52,74.17 56.26,74.42 9.91,74.42 7.37,71.88
  pour Top (no thermals): 50.8,65.41 56.52,65.41 56.52,72.01 50.8,72.01
  pour Top (no thermals): 7.37,58.29 9.27,58.29 9.27,56.77 7.37,56.77
-5V  (via drill 0.25, 0.35)
  Top 0.305: P3.P$1 53.21,58.17 v53.34,58.04
  Top 0.61: IC5.4 C26.P$2 | C26.P$2 14.97,61.21 v14.1,61.21 | v14.1,60.45 14.59,60.95 C26.P$2
  other vias: 10.79,50.42 11.81,52.07 10.92,55.88 10.92,55.12 52.07,52.32 53.21,52.32 54.36,52.32 52.32,57.15 52.32,56.01 54.61,57.15 54.61,56.01 55.37,54.23 55.37,53.21 51.31,54.36 51.31,53.21 53.34,55.12 11.3,51.44 11.68,55.88 11.68,55.12
  pour Top (no thermals): 10.16,49.53 10.16,51.94 12.06,51.94 12.06,51.31 10.29,49.53
  pour Bottom (no thermals): 55.63,48.39 55.63,61.72 10.03,61.72 10.03,48.39
  pour Top (no thermals): 51.05,51.44 51.05,58.55 56.13,58.55 56.13,51.44
  pour Top (no thermals): 9.27,56.26 9.27,54.86 13.34,54.86 13.34,56.26
CLK-SEL  (via drill 0.35)
  Top 0.33: v18.92,31.11 31.11,31.11 32.89,29.34 32.89,28.32 31.66,27.09 IC4.27
  Top 0.349: IC8.16 14.23,30.34 v13.97,30.61
  Bottom 0.33: v13.97,30.61 14.48,31.11 v18.92,31.11
CLOCK-OUT
  Top 0.127: J4.P$3 J4.CENTER@1
  Top 0.349: R27.2 R28.2 R19.2 8.14,26.55 8.13,26.54 8.14,26.54 | 8.14,26.54 R20.2 R25.2 | 8.14,26.54 J4.CENTER@1
COMP-CLK
  Top 0.349: IC8.12 16.84,28.12 19.43,25.53 25.91,25.53 33.27,18.16 36.55,18.16 IC4.14
COMP-OUT
  Top 0.349: IC9.4 34.86,7.31 IC4.11
COMP-REG-CLK  (via drill 0.35)
  Top 0.349: v24,7.11 U$140.2 | IC8.6 17.48,21.63 v17.53,21.59
  Bottom 0.349: v17.53,21.59 17.53,9.65 arc90 20.07,7.11 v24,7.11
D0  (via drill 0.35)
  Top 0.254: IC4.38 23.66,21.37 23.62,21.34 v23.56,21.4 | v26.8,37.85 24.97,37.85 IC3.23
  Bottom 0.254: v23.56,21.4 23.56,28.89 28.07,33.4 28.07,36.58 v26.8,37.85
D1  (via drill 0.35)
  Top 0.254: IC3.25 26.54,34.54 v26.16,34.16 | v21.46,20.57 IC4.39
  Bottom 0.254: v26.16,34.16 21.46,29.46 v21.46,20.57
D2  (via drill 0.35)
  Top 0.254: IC3.26 27.46,35.35 27.46,34.58 v26.16,33.27 | v22.1,19.68 22.19,19.77 IC4.40
  Bottom 0.254: v26.16,33.27 22.1,29.21 v22.1,19.68
D3  (via drill 0.35)
  Top 0.254: IC3.27 28.14,34.36 v27.05,33.27 | v22.86,19.05 25.09,19.05 IC4.41
  Bottom 0.254: v22.86,19.05 22.86,29.08 v27.05,33.27
D4  (via drill 0.35)
  Top 0.254: IC3.29 29.74,34.18 v28.45,32.89 | v27.62,16.19 27.62,14.91 IC4.2
  Bottom 0.254: v28.45,32.89 24.26,28.7 24.26,19.81 27.75,16.32 v27.62,16.19
D5  (via drill 0.35)
  Top 0.254: IC3.30 30.54,34.09 v29.34,32.89 | v28.45,16.64 28.45,14.89 IC4.3
  Bottom 0.254: v29.34,32.89 24.89,28.45 24.89,20.19 v28.45,16.64
D6  (via drill 0.35)
  Top 0.254: IC3.31 31.34,34 v30.23,32.89 | v29.21,16.26 29.21,14.93 IC4.4
  Bottom 0.254: v30.23,32.89 25.53,28.19 25.53,20.45 29.21,16.76 v29.21,16.26
D7  (via drill 0.35)
  Top 0.254: IC3.32 32.14,34.04 v31.11,33.02 | IC4.5 30.1,14.91 v30.1,16.64
  Bottom 0.254: v31.11,33.02 26.29,28.19 26.29,20.45 v30.1,16.64
D8  (via drill 0.35)
  Top 0.254: IC4.25 33.26,27.04 33.27,27.05 v33.27,27.43 | v33.53,35.31 33.74,35.52 IC3.1
  Bottom 0.254: v33.53,35.31 33.4,35.18 33.4,27.56 v33.27,27.43
D9  (via drill 0.35)
  Top 0.254: IC3.2 33.7,37.85 v32.13,37.85 | v32.38,25.02 32.38,26.2 IC4.26
  Bottom 0.254: v32.38,25.02 32.38,27.32 32.92,27.85 32.92,37.06 v32.13,37.85
GND  (via drill 0.25, 0.35, 0.4)  (6 unrouted)
  other vias: 10.41,44.07 11.05,44.07 12.83,46.35 11.18,42.93 11.56,42.04 12.32,42.04 4.45,53.98 4.45,54.74 8,44.07 8.64,44.07 12.06,45.59 12.95,50.67 13.08,51.56 12.45,51.56 14.35,51.82 10.29,52.96 10.92,52.96 8.38,52.96 9.02,52.96 7.87,52.2 7.34,50.04 9.27,50.7 11.81,27.18 11.81,25.91 18.16,28.07 18.16,25.02 18.16,30.48 18.16,22.61 13.97,27.18 13.97,25.91 5.33,10.79 7.24,10.79 6.35,10.03 5.84,14.35 6.73,15.24 29.72,12.7 30.61,11.68 29.72,29.59 28.83,28.57 30.1,27.56 30.86,13.59 30.86,16.13 30.1,25.02 29.46,61.47 29.46,64.01 32,64.01 32,61.47 32,66.8 30.73,66.8 30.73,69.34 32,69.34 30.73,71.25 29.59,59.44 19.18,59.82 20.19,60.71 18.16,60.71 21.84,66.8 21.84,69.34 12.7,72.52 13.72,71.63 11.68,71.63 13.97,59.44 15.24,58.55 16.26,59.44 11.68,59.44 12.7,58.55 17.02,59.94 15.62,54.46 15.09,53.47 17.75,42.6 19.2,43.54 18.52,42.6 16.51,54.46 35.81,35.56 35.05,35.56 35.81,44.2 35.18,44.2 36.83,45.34 5.21,43.31 4.45,43.31 4.45,40.26 5.21,40.26 49.15,70.99 49.15,70.23 49.15,69.47 50.16,71.75 50.16,68.71 45.85,66.04 44.58,66.04 47.12,66.04 47.12,64.77 45.85,64.77 44.58,64.77 44.58,63.5 45.85,63.5 47.12,63.5 47.12,67.31 45.85,67.31 44.58,67.31 43.31,67.31 43.31,66.04 43.31,64.77 43.31,63.5 48.39,67.31 48.39,66.04 48.39,64.77 48.39,63.5 50.93,37.59 50.93,36.7 50.93,35.81 48.77,37.72 48.77,36.7 48.77,35.69 53.98,26.8 53.98,25.91 53.98,25.02 51.82,26.8 51.82,25.91 51.82,25.02 55.5,29.72 55.5,28.7 52.83,29.59 52.83,28.57 18.57,46.58 21.23,46.58 19.96,45.82 21.74,52.81 21.74,50.65 22.63,51.66 21.74,37.19 21.62,42.9 20.73,38.2 20.73,41.76 28.47,48.49 29.36,48.49 24.28,36.3 25.17,36.3 31.39,42.9 32.92,44.68 32.66,45.57 28.73,34.14 28.98,36.8 50.29,61.34 51.18,60.58 51.18,59.69 50.29,58.8 49.28,60.83 49.28,59.56 49.28,56.52 49.28,55.63 50.04,55.12 49.28,57.4 55.37,49.66 55.37,48.77 51.18,49.78 51.18,48.64 52.32,50.67 53.34,50.67 54.48,50.67 52.2,47.75 53.34,47.75 54.48,47.75 50.55,46.86 50.55,45.72 52.7,46.86 52.7,45.72 47.62,22.23 47.62,21.34 47.62,20.45 46.61,23.11 45.34,22.35 45.34,21.46 52.32,14.48 52.32,13.46 49.53,14.48 49.53,13.34 50.93,11.56 50.93,10.54 50.93,9.53 48.51,11.56 48.51,10.54 48.51,9.53 10.92,57.91 10.92,57.28 14.99,55.88 14.99,55.12 34.42,30.61 37.08,30.73 35.18,29.72 36.07,29.72 41.27,31.37 42.04,31.37 20.95,12.57 22.73,12.57 40.89,36.07 41.15,35.43 41.15,34.8 32.26,6.22 30.35,6.22 31.24,5.33 26.29,6.1 24.38,6.1 25.27,5.33 25.78,10.79 24.89,10.29 24.89,9.53 30.86,10.16 30.86,9.4 11.56,5.08 1.27,1.27 5.21,1.27 7.75,1.27 10.29,1.27 12.83,1.27 22.99,1.27 25.53,1.27 28.07,1.27 45.85,1.27 48.39,1.27 50.93,1.27 53.47,1.27 56.01,1.27 58.55,1.27 61.09,1.27 63.63,1.27 1.27,3.81 1.27,6.35 1.27,17.78 1.27,20.32 1.27,31.75 1.27,34.29 1.27,36.83 1.27,39.37 1.27,41.91 1.27,54.61 1.27,57.15 1.27,59.69 1.27,62.23 1.27,64.77 1.27,67.31 1.27,69.85 1.27,72.39 5.21,72.39 7.75,72.39 10.29,72.39 15.37,72.39 21.72,72.39 33.15,72.39 35.69,72.39 38.23,72.39 40.77,72.39 43.31,72.39 30.61,73.66 26.8,73.66 45.85,73.66 48.39,73.66 50.93,73.66 54.74,73.66 56.01,72.39 58.55,72.39 61.09,72.39 63.63,72.39 63.63,69.85 63.63,67.31 63.63,54.61 63.63,52.07 63.63,49.53 63.63,38.1 63.63,35.56 63.63,33.02 63.63,30.48 63.63,27.94 63.63,15.24 63.63,12.7 63.63,10.16 63.63,7.62 63.63,5.08 17.91,38.1 15.37,38.1 12.83,38.1 10.29,38.1 8.76,8.89 11.3,8.89 11.3,12.7 13.84,12.7 13.84,8.89 30.23,22.86 30.61,19.05 28.07,21.59 32.64,20.57 28.19,24.64 35.05,23.62 34.16,21.84 32.38,23.62 27.05,23.24 28.7,19.18 4.95,50.93 5.59,50.93 4.95,46.61 5.59,46.61 6.1,47.62 6.1,46.99 6.1,50.55 6.1,49.91
  pour Top (rank 2, no thermals): 0,0 65.66,0 65.66,74.42 0,74.42
  pour Route2 (no thermals): 0,0 0,74.42 65.66,74.42 65.66,0
  cutout Top (no thermals): 8.76,47.37 8.76,42.67 arc90 12.32,39.12 25.78,39.12 25.78,40.77 23.5,40.77 arc-90 23.24,41.02 arc90 22.73,41.53 22.1,41.53 arc90 21.59,41.02 21.59,40.77 arc-90 21.46,40.64 12.45,40.64 arc-90 10.29,42.8 10.29,47.24 arc90 10.03,47.5 8.89,47.5 arc90
  cutout Top (no thermals): 32.89,42.04 32.89,38.1 44.07,38.1 44.07,42.04
  pour Bottom (rank 2, no thermals): 0,0 65.66,0 65.66,74.42 0,74.42
  cutout Top: 8.38,49.78 4.57,49.78 4.57,47.75 8.38,47.75
  cutout Route2: 4.83,49.78 4.83,47.75 5.84,47.75 5.84,49.78
  cutout Top: 8.51,49.53 10.54,49.53 10.54,47.5 8.51,47.5
ICSPCLK
  Top 0.254: IC4.16 37.88,19.77 38.35,19.3 38.35,8.13 33.53,3.3 J2.5
ICSPDAT
  Top 0.254: IC4.17 38.23,20.57 39.12,19.68 39.12,7.87 36.07,4.83 J2.4
INPUT
  Top 0.203: U$1.2 5.46,48.76 5.46,48.77 | R26.2 5.33,48.9 5.46,48.77 | R34.1 5.33,48.64 5.46,48.77
  Top 0.305: J1.P$3 5.46,48.77
  Top 0.349: 5.46,48.77 J1.CENTER@1
LE_N
  Top 0.305: IC3.21 23.89,39.48 23.72,39.65 12.3,39.65 arc-90 9.28,42.67 U$1.6
LE_P1
  Top 0.305: IC3.20 23.89,40.28 23.72,40.11 23.21,40.11 arc-90 22.9,40.42 22.9,40.44 arc90 22.59,40.75 22.47,40.75 arc90 22.16,40.44 22.16,40.42 arc-90 21.84,40.11 12.34,40.11 arc-90 9.78,42.67 U$1.7
N$1
  Top 0.349: U$36.4 10.39,10.86 arc90 R31.P$1
N$2
  Top 0.254: U$1.14 R1.P$1
N$3
  Top 0.305: U$1.11 14.19,48.77 IC2.2
  Top 0.349: R3.P$2 R5.P$1 16.13,49.53 15.75,49.15 IC2.2
N$4
  Top 0.305: U$1.10 14.19,48.26 IC2.3
  Top 0.349: IC2.3 15.75,47.88 16.26,47.37 R2.P$2 R4.P$1
N$5
  Top 0.406: R6.P$2 R7.P$1 12.06,44.56 10.79,45.84 C2.2
  pour Top (no thermals): 10.16,47.5 10.16,45.47 11.18,45.47 11.18,46.61 10.29,47.5
N$6
  Top 0.254: IC3.16 R11.2
N$7
  Top 0.254: IC3.12 29.74,46.38 R10.2
N$8
  Top 0.254: IC3.11 30.54,45.78 R9.2
N$9
  Top 0.254: IC3.10 31.34,45.19 R8.2
N$16
  Top 0.349: 34.42,39.48 42.15,39.48 arc90 43.43,40.77 IC6.2 | 34.42,39.48 IC3.4 | 34.42,39.48 35.56,38.34 R23.P$1 R21.P$2
N$17
  Top 0.349: IC2.7 R32.P$1
N$18
  Top 0.349: IC8.11 17.48,32.21 R18.P$1
N$19
  Top 0.349: U$140.4 29.15,6.16 30.1,7.11 IC9.2
N$20
  Top 0.508: R13.P$1 18.57,64.55 C20.P$2 16.92,64.53 R14.P$2 | R14.P$2 R12.P$2 | R14.P$2 12.99,64.55 12.7,64.26 IC5.2
N$22
  Top 0.349: 34.54,40.28 37.97,40.28 arc90 38.31,40.61 arc-90 38.64,40.95 38.68,40.95 arc-90 39.01,40.61 arc90 39.35,40.28 39.39,40.28 arc90 39.72,40.61 arc-90 40.05,40.95 40.09,40.95 arc-90 40.43,40.61 arc90 40.76,40.28 40.91,40.28 arc90 42.16,41.53 IC6.3 | 34.54,40.28 IC3.5 | 34.54,40.28 35.56,41.29 R24.P$1 R22.P$2
N$23
  Top 0.349: R31.P$2 16.25,10.92 arc90 18.79,13.46 IC8.8
N$24
  Top 0.305: X1.3 35.72,25.43 34.54,24.26 29.84,24.26 29.26,24.84 IC4.30
N$25
  Top 0.305: IC4.42 22.78,18.17 R33.P$1
N$26
  Top 0.305: R33.P$2 U$88.A
N$27  (via drill 0.35)
  Top 0.349: v29.84,8.13 31.25,8.13 arc-90 IC9.1 | v19.94,42.42 19.94,42.67 arc-90 22.35,45.09 arc90 23.59,46.32 R32.P$2
  Bottom 0.349: v19.94,42.42 19.94,10.92 arc90 22.73,8.13 v29.84,8.13
N$28
  Top 0.508: R15.P$2 9.65,66.38 13.3,66.38 13.97,67.06 IC5.6
N$35
  Top 0.254: IC3.3 32.57,38.68 32.13,39.12 32.13,42.8 34.8,45.47 34.8,46.1 35.52,46.83 R16.P$2
N$36
  Top 0.349: R18.P$2 36.96,32.26 arc90 39.5,34.8 39.5,37.97 arc-90 40.26,38.73 42.93,38.73 arc-90 43.43,38.23 IC6.7
N$38
  Top 0.349: R28.1 12.31,31.37 14.73,31.37 15.54,30.57 IC8.14
N$39
  Top 0.349: R27.1 11.93,32.13 15.03,32.13 16.18,30.97 IC8.13
N$41
  Top 0.349: IC8.5 16.84,21.91 16.13,21.21 11.56,21.21 9.91,22.86 9.91,24.51 9.65,24.77 R25.1
N$42
  Top 0.349: IC8.4 16.18,22.41 15.62,21.84 11.81,21.84 10.54,23.11 10.54,24.89 9.53,25.91 R20.1
N$43
  Top 0.349: IC8.3 15.54,22.77 15.24,22.48 12.03,22.48 11.14,23.37 11.14,25.04 R19.1
N$44
  Top 0.349: IC4.44 25.16,13.95 19.05,7.84 R29.P$1
N$45
  Top 0.349: IC4.1 26.86,13.62 R30.P$1
RX
  Top 0.349: U$54.3 R30.P$2
SAMPLE-CLOCK
  Top 0.349: IC8.9 26.13,29.24 27.69,27.69 27.69,26.3 IC4.32
TRIGGER  (2 unrouted)
  Top 0.349: U$36.2 J3.P$3
TX
  Top 0.349: U$54.1 16.13,6.01 R29.P$2
V2.048
  Top 0.305: P7.P$1 26.54,69.76 IC7.8
  Top 0.508: C4.P$2 29.46,70.12 IC7.7 IC7.8 28.19,66.67 27.43,65.91 26.38,65.91 R13.P$2 23.91,66 23.11,66.8 IC1.6
VCC2  (via drill 0.35)
  Top 0.254: R17.P$1 41.15,4.03 J2.2
  Top 0.508: IC4.7 31.66,13.16 C23.P$2 | IC4.28 30.86,28.21 C22.P$2 31.37,28.71 | v31.37,29.59 31.37,28.71 | v32.13,28.57 31.51,28.57 31.37,28.71
  Top 1.016: IC11.2 IC11.4
  other vias: 9.14,14.35 8.26,15.24 7.62,12.83 33.02,12.7 43.18,17.78 44.45,17.78 45.72,17.78 43.18,16.51 44.45,16.51 45.72,16.51 45.72,15.24 44.45,15.24 43.18,15.24 43.18,13.97 44.45,13.97 45.72,13.97 45.72,19.05 44.45,19.05 43.18,19.05 46.99,19.05 46.99,17.78 46.99,16.51 46.99,15.24 46.99,13.97 43.18,12.7 44.45,12.7 44.45,11.43 43.18,11.43 46.61,12.32 46.61,9.02 45.34,10.67 38.23,28.45 38.23,27.43 42.04,27.81 38.23,29.34 32.13,11.68 33.27,10.79 34.16,9.78 27.3,10.79 28.19,9.78 28.19,10.79 41.27,27.81
  pour Top (no thermals): 7.37,15.49 7.37,12.19 9.4,12.19 9.4,15.49
  pour Route15 (no thermals): 0,0 52.83,0 52.83,22.73 47.62,22.73 39.24,31.11 27.05,31.11 21.08,25.15 21.08,21.21 18.16,18.29 0,18.29
  pour Top (no thermals): 47.62,8.13 47.62,19.81 42.42,19.81 42.42,8.13
  pour Top (no thermals): 37.85,29.84 42.42,29.84 42.42,27.81 41.66,27.05 37.85,27.05
  pour Top (no thermals): 32.64,7.62 34.42,7.62 34.42,13.34 31.5,13.34 31.5,11.3 32.64,10.16
  pour Top (no thermals): 26.54,11.18 26.54,7.62 28.57,7.62 28.57,11.18
VDAC  (via drill 0.35)
  Top 0.305: P2.P$1 18.92,68.2 18.83,68.11
  Top 0.508: IC1.8 18.83,68.11 v18.8,68.07 | v11.56,60.96 11.57,60.95 C5.P$2 13.97,62.22 IC5.3
  Bottom 0.508: v18.8,68.07 18.67,68.07 v11.56,60.96
VIN3.3
  Top 1.27: IC10.3 52.98,34.91 C7.P$2 54.86,36.7 60.58,30.99 J7.P$1 56.01,24.13 53.34,21.46 C9.P$2 49.68,19.68 IC11.3
VIN+5
  Top 1.27: J6.P$1 53.47,62.87 IC13.1 53.37,62.97 C13.P$2
VIN-5  (via drill 0.35)
  Top 1.27: J5.P$1 55.75,46.35 53.21,43.81 49.66,43.81 48.49,44.98 C11.P$2 46.16,48.56 IC12.4
  other vias: 47.62,53.47 46.35,53.47 45.09,53.47 43.81,53.47 43.81,52.2 45.09,52.2 46.35,52.2 47.62,52.2 47.62,50.93 46.35,50.93 45.09,50.93 43.81,50.93 43.81,49.66 45.09,49.66 46.35,49.66 47.62,49.66 48.9,53.47 48.9,52.2 48.9,50.93 48.9,49.66
  pour Top (no thermals): 42.67,55.24 42.67,46.99 49.66,46.99 49.66,55.24
VREF  (via drill 0.35)
  Top 0.305: P1.P$1 6.57,61.85 6.73,62.01 | U$1.3 7.37,48.26 v6.73,47.62
  Top 0.349: v6.73,53.09 6.73,54.24 | 6.73,54.24 C1.P$2 | R15.P$1 6.73,62.01 6.73,54.24
  Top 0.508: C20.P$1 16.92,66.03 | 16.92,66.03 R14.P$1 | R15.P$1 10.2,64.68 10.92,65.41 15.49,65.41 16.12,66.03 16.92,66.03
  Bottom 0.349: v6.73,47.62 v6.73,53.09
VREF-!CS!  (via drill 0.35)
  Top 0.349: IC1.2 21.84,56.26 23.75,54.36 36.07,54.36 39.37,51.05 v39.37,47.12 | v32.45,16.32 32.46,16.31 IC4.8
  Bottom 0.349: v39.37,47.12 39.37,24.38 32.45,17.46 v32.45,16.32
VREF-SCK  (via drill 0.35)
  Top 0.349: IC1.3 23.11,56.64 24.26,55.5 36.45,55.5 40.26,51.69 v40.26,45.97 | v33.26,16.7 IC4.9 | IC4.9
  Bottom 0.349: v40.26,45.97 40.01,45.72 40.01,23.88 33.26,17.13 v33.26,16.7
VREF-SDI  (via drill 0.35)
  Top 0.349: IC1.4 24.38,57.4 25.15,56.64 36.96,56.64 41.15,52.45 v41.15,45.47 | IC4.10 | v34.06,16.26 IC4.10
  Bottom 0.349: v41.15,45.47 42.29,44.32 42.29,34.04 40.64,32.38 40.64,23.24 34.06,16.66 v34.06,16.26

### Text on the board
tPlace: Vdac | 2.048 | +5 | +7.5 | Vref | -5 | ADCMP582 Sampler | Yapo 2019 | -7.5 | Input | GND | +4.5 | ECL | +3.3 | Clock Out | GND | CMOS | +3.3 | Trigger | G | TX | RX | ICSP | 1
bPlace: +7.5 | GND | Input | -7.5 | GND | Clock Out | +4.5 | Trigger | GND